# Altium schematic sheet xCore_Peripheral_pull_up.SchDoc
size A4; SheetNumber: 7; SheetTotal: 7
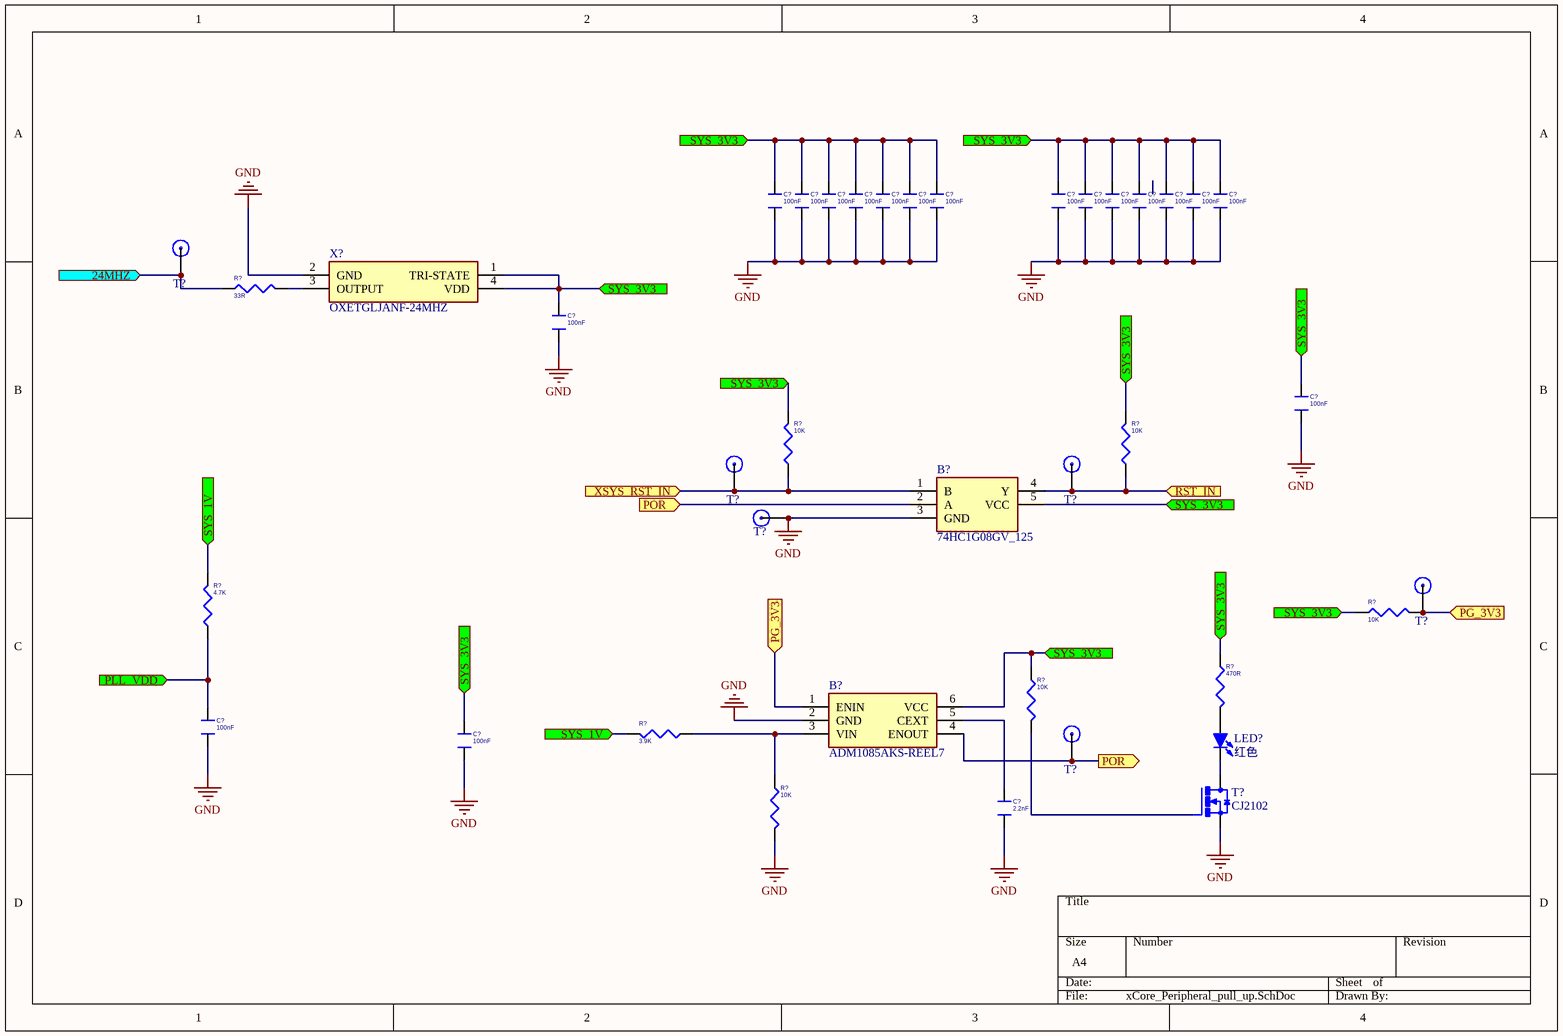
[diagram p0: xCore_Peripheral_pull_up.SchDoc]

## Parts
(Parts that share a designator on the sheet are numbered #1, #2 ... from top to bottom, then left to right.)
B?#1  74HC1G08GV_125  [SOT65P212X110-5N]
B?#2  ADM1085AKS-REEL7  [SOT65P210X110-6N]
C?#1  100nF  [C0603]
C?#2  100nF  [C0603]
C?#3  100nF  [C0603]
C?#4  100nF  [C0603]
C?#5  100nF  [C0603]
C?#6  100nF  [C0603]
C?#7  100nF  [C0603]
C?#8  100nF  [C0603]
C?#9  100nF  [C0603]
C?#10  100nF  [C0603]
C?#11  100nF  [C0603]
C?#12  100nF  [C0603]
C?#13  100nF  [C0603]
C?#14  100nF  [C0603]
C?#15  100nF  [C0603]
C?#16  100nF  [C0603]
C?#17  100nF  [C0603]
C?#18  100nF  [C0603]
C?#19  2.2nF  [C0603]
LED?  红色  [LED 0805G]
R?#1  33R  [R0402]
R?#2  10K  [R0402]
R?#3  10K  [R0402]
R?#4  4.7K  [R0402]
R?#5  10K  [R0402]
R?#6  470R  [R0402]
R?#7  10K  [R0402]
R?#8  3.9K  [R0402]
R?#9  10K  [R0402]
T?#1  Test_point  [Test_point]  (value not drawn)
T?#2  Test_point  [Test_point]  (value not drawn)
T?#3  Test_point  [Test_point]  (value not drawn)
T?#4  Test_point  [Test_point]  (value not drawn)
T?#5  Test_point  [Test_point]  (value not drawn)
T?#6  Test_point  [Test_point]  (value not drawn)
T?#7  CJ2102  [SOT23]
X?  OXETGLJANF-24MHZ  [OXETGLJANF24MHZ]

## Ports
24MHZ (in), PG_3V3 (in), PLL_VDD (in), POR (in), POR (out), RST_IN (in), SYS_1V (in), SYS_3V3 (in), XSYS_RST_IN (in)

## Nets
GND: B?#1.3(GND) B?#2.2(GND) C?#1.2 C?#2.2 C?#3.2 C?#4.2 C?#5.2 C?#6.2 C?#7.2 C?#8.2 C?#9.2 C?#10.2 C?#11.2 C?#12.2 C?#13.2 C?#14.2 C?#15.2 C?#16.2 C?#17.2 C?#18.2 C?#19.2 R?#9.2 T?#4.1 T?#7.2(S) X?.2(GND)
24MHZ: R?#1.1 T?#1.1 ; port 24MHZ
PG_3V3: B?#2.1(ENIN) R?#5.2 T?#5.1 ; port PG_3V3
PLL_VDD: C?#17.1 R?#4.1 ; port PLL_VDD
POR: B?#1.2(A) B?#2.4(ENOUT) T?#6.1 ; port POR
RST_IN: B?#1.4(Y) R?#3.1 T?#3.1 ; port RST_IN
SYS_1V: R?#4.2 R?#8.2 ; port SYS_1V
SYS_3V3: B?#1.5(VCC) B?#2.6(VCC) C?#1.1 C?#2.1 C?#3.1 C?#4.1 C?#5.1 C?#6.1 C?#7.1 C?#8.1 C?#9.1 C?#10.1 C?#11.1 C?#12.1 C?#13.1 C?#14.1 C?#15.1 C?#16.1 C?#18.1 R?#2.2 R?#3.2 R?#5.1 R?#6.1 R?#7.1 X?.1(TRI-STATE) X?.4(VDD) ; port SYS_3V3
XSYS_RST_IN: B?#1.1(B) R?#2.1 T?#2.1 ; port XSYS_RST_IN
NetB?#2_3: B?#2.3(VIN) R?#8.1 R?#9.1
NetB?#2_5: B?#2.5(CEXT) C?#19.1
NetLED?_1: LED?.1 R?#6.2
NetLED?_2: LED?.2 T?#7.3(D)
NetR?#1_2: R?#1.2 X?.3(OUTPUT)
NetR?#7_2: R?#7.2 T?#7.1(G)

## Library data of the parts
B?#1 = 74HC1G08GV_125: 74HC(T)1G08 - 2-input AND gate@en-us; Manufacturer_Name: Nexperia; Manufacturer_Part_Number: 74HC1G08GV,125; Geometry.Height: 1.1mm; Mouser Part Number: 771-74HC1G08GV; Mouser Price/Stock: https://www.mouser.co.uk/ProductDetail/Nexperia/74HC1G08GV125?qs=P62ublwmbi9shys2yLaZlQ%3D%3D; Arrow Part Number: 74HC1G08GV,125; Arrow Price/Stock: https://www.arrow.com/en/products/74hc1g08gv125/nexperia?region=nac; Datasheet Link: https://assets.nexperia.com/documents/data-sheet/74HC_HCT1G08.pdf
B?#2 = ADM1085AKS-REEL7: IC SIMPLE SEQUENCER OD SC70-6; Manufacturer_Name: Analog Devices; Geometry.Height: 1.1mm; Manufacturer_Part_Number: ADM1085AKS-REEL7; Mouser Part Number: *; Mouser Price/Stock: *; Arrow Part Number: *; Arrow Price/Stock: *; Datasheet Link: http://www.analog.com/media/en/technical-documentation/data-sheets/ADM1085_1086_1087.pdf
C?#1-C?#19 = CAPACITOR_0_Dup3: CAP ±20%/10V/X5R/SMT0603; PAGE: 1
LED? = LED-SMD: 贴片LED; 版权归属: 源创客; BOM名称: 贴片LED; 学习资源: www.ooocke.com
R?#1-R?#9 = R_0603: RES 1/8W 5% SMT0603
T?#7 = CJ2102: N-Channel 20V  2.1ASOT-323; MP: MMBF170; MF: ON Semiconductor; Availability: Unavailable; Package: SOT-23 ON Semiconductor; SnapEDA_Link: https://www.snapeda.com/parts/MMBF170/ON%20Semiconductor/view-part/1400962/?ref=snap; Price: None; Value: *
X? = OXETGLJANF-24MHZ: 3.3V~3.3V -40~+85 15mA +/-50ppm 24MHz SMD3225-4P Oscillators ROHS; Manufacturer_Name: TAITIEN; Geometry.Height: 1.1mm; Manufacturer_Part_Number: OXETGLJANF-24MHZ; Mouser Part Number: *; Mouser Price/Stock: *; Arrow Part Number: *; Arrow Price/Stock: *; Datasheet Link: https://datasheet.lcsc.com/lcsc/1811052217_TAITIEN-Elec-OXETGLJANF-24MHZ_C295524.pdf